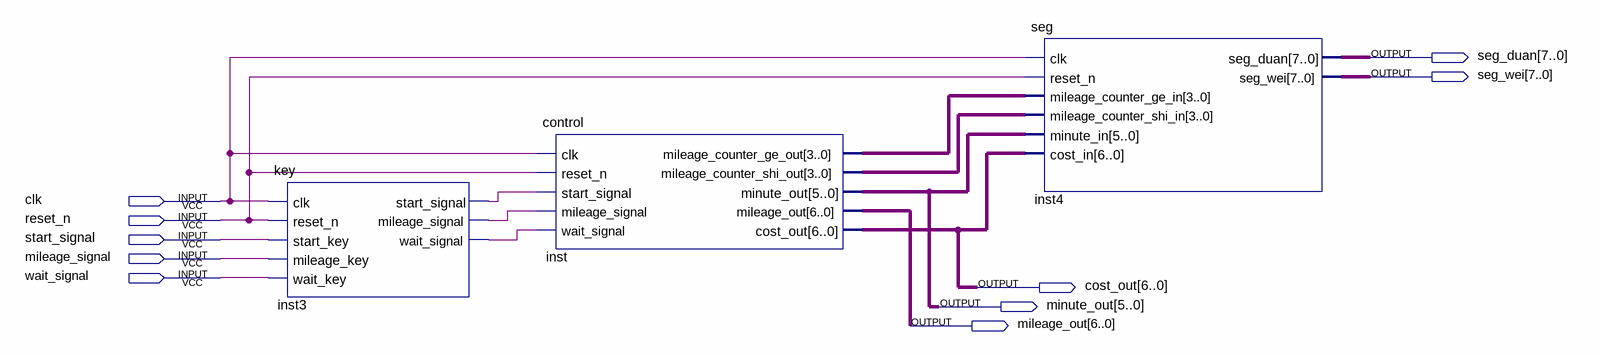
[diagram p0: schematic sheet]
// Quartus schematic time.bdf as structural Verilog: 3 symbols, 10 pins
module \time  (
  input  clk,
  input  reset_n,
  input  start_signal,
  input  mileage_signal,
  input  wait_signal,
  output [7:0] seg_duan,
  output [7:0] seg_wei,
  output [6:0] cost_out,
  output [5:0] minute_out,
  output [6:0] mileage_out
);

  wire inst3_mileage_signal, inst3_start_signal, inst3_wait_signal;
  wire [3:0] inst_mileage_counter_ge_out, inst_mileage_counter_shi_out;

  key inst3 (
    .clk(clk), .reset_n(reset_n), .start_key(start_signal), .mileage_key(mileage_signal),
    .wait_key(wait_signal), .start_signal(inst3_start_signal), .mileage_signal(inst3_mileage_signal),
    .wait_signal(inst3_wait_signal));
  control inst (
    .clk(clk), .reset_n(reset_n), .start_signal(inst3_start_signal), .mileage_signal(inst3_mileage_signal),
    .wait_signal(inst3_wait_signal), .mileage_counter_ge_out(inst_mileage_counter_ge_out),
    .mileage_counter_shi_out(inst_mileage_counter_shi_out), .minute_out(minute_out),
    .mileage_out(mileage_out), .cost_out(cost_out));
  seg inst4 (
    .clk(clk), .reset_n(reset_n), .mileage_counter_ge_in(inst_mileage_counter_ge_out),
    .mileage_counter_shi_in(inst_mileage_counter_shi_out), .minute_in(minute_out), .cost_in(cost_out),
    .seg_duan(seg_duan), .seg_wei(seg_wei));
endmodule
